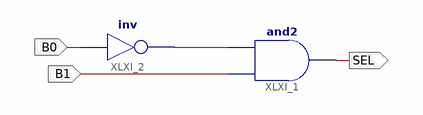
[diagram p0: schematic sheet 1]
// Xilinx ISE schematic Add_Sub_Select.sch (spartan3e) as structural Verilog: 2 symbols, 3 ports
module Add_Sub_Select (
  input  B1,
  input  B0,
  output SEL
);

  wire XLXN_1;

  and XLXI_1 (SEL, B1, XLXN_1);
  not XLXI_2 (XLXN_1, B0);
endmodule
